# Altium schematic sheet modFOC-5VSupply.SchDoc
size A4; Organization: Altium Limited; Address1: L3, 12a Rodborough Rd; Address2: Frenchs Forest; Address3: NSW; Address4: Australia 2086
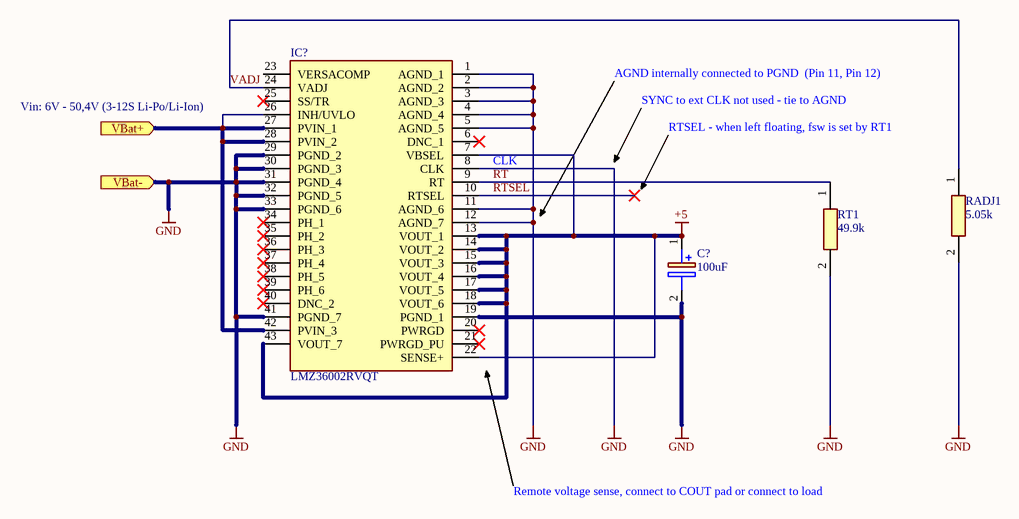
[diagram p0: modFOC-5VSupply.SchDoc]

## Parts
C?  100uF  [CAPPM3528X200N]
IC?  LMZ36002RVQT  [LMZ36002RVQR]
RADJ1  5.05k  [R0805]
RT1  49.9k  [R0805]

## Ports
VBat+ (in), VBat- (in)

## Nets
+5: C?.1(+) IC?.7(VBSEL) IC?.13(VOUT_1) IC?.14(VOUT_2) IC?.15(VOUT_3) IC?.16(VOUT_4) IC?.17(VOUT_5) IC?.18(VOUT_6) IC?.22(SENSE+) IC?.43(VOUT_7)
GND: C?.2(-) IC?.1(AGND_1) IC?.2(AGND_2) IC?.3(AGND_3) IC?.4(AGND_4) IC?.5(AGND_5) IC?.8(CLK) IC?.11(AGND_6) IC?.12(AGND_7) IC?.19(PGND_1) IC?.29(PGND_2) IC?.30(PGND_3) IC?.31(PGND_4) IC?.32(PGND_5) IC?.33(PGND_6) IC?.41(PGND_7) RADJ1.2 RT1.2 ; port VBat-
RT: IC?.9(RT) RT1.1
RTSEL: IC?.10(RTSEL)
VADJ: IC?.24(VADJ) RADJ1.1
VBat+: IC?.26(INH/UVLO) IC?.27(PVIN_1) IC?.28(PVIN_2) IC?.42(PVIN_3) ; port VBat+

Not connected (* = marked no-connect by the designer): IC? 6(DNC_1)* 20(PWRGD)* 21(PWRGD_PU)* 23(VERSACOMP) 25(SS/TR)* 34(PH_1)* 35(PH_2)* 36(PH_3)* 37(PH_4)* 38(PH_5)* 39(PH_6)* 40(DNC_2)*

## Notes on the sheet
- AGND internally connected to PGND  (Pin 11, Pin 12)
- (near IC?) Vin: 6V - 50,4V (3-12S Li-Po/Li-Ion)
- SYNC to ext CLK not used - tie to AGND
- RTSEL - when left floating, fsw is set by RT1
- (near IC?) CLK
- Remote voltage sense, connect to COUT pad or connect to load
- Title
- Size:
- Date:
- A4
- Number:
- Time:
- Revision:
- Sheet
- of
- File:

## Library data of the parts
C? = 8TPE100MAZB: Capacitor Polarised; Manufacturer_Name: Panasonic; Datasheet Link: http://uk.rs-online.com/web/p/products/7887374; Height: 2mm; Manufacturer_Part_Number: 8TPE100MAZB; Arrow Part Number: 8TPE100MAZB; Arrow Price/Stock: https://www.arrow.com/en/products/8tpe100mazb/panasonic; Mouser Part Number: 667-8TPE100MAZB; Mouser Price/Stock: https://www.mouser.co.uk/ProductDetail/Panasonic/8TPE100MAZB?qs=OE1iw1LrrPHKTwwfsidxgA%3D%3D
IC? = LMZ36002RVQT: Integrated Circuit; Manufacturer_Name: Texas Instruments; Datasheet Link: http://www.ti.com/lit/gpn/lmz36002; Height: 2.13mm; Manufacturer_Part_Number: LMZ36002RVQT; Arrow Part Number: LMZ36002RVQT; Arrow Price/Stock: https://www.arrow.com/en/products/lmz36002rvqt/texas-instruments; Mouser Part Number: 595-LMZ36002RVQT; Mouser Price/Stock: https://www.mouser.co.uk/ProductDetail/Texas-Instruments/LMZ36002RVQT?qs=kFLL9AfgRSBjXTxBMSjGOw%3D%3D
RADJ1 = RT0805BRD075K05L: Resistor; Manufacturer_Name: Yageo; Datasheet Link: https://www.mouser.at/datasheet/2/447/PYu-RT_1-to-0.01_RoHS_L_11-1669912.pdf; Height: 0.7mm; Manufacturer_Part_Number: RT0805BRD075K05L; Mouser Part Number: 603-RT0805BRD075K05L; Mouser Price/Stock: https://www.mouser.at/ProductDetail/Yageo/RT0805BRD075K05L?qs=bQfrgN9vNvwObDVrZ%2FDM5w%3D%3D
RT1 = ERJ-6ENF4992V: Resistor; Manufacturer_Name: Panasonic; Datasheet Link: https://industrial.panasonic.com/cdbs/www-data/pdf/RDA0000/AOA0000C84.pdf; Height: 0.7mm; Manufacturer_Part_Number: ERJ-6ENF4992V; Mouser Part Number: 667-ERJ-6ENF4992V; Mouser Price/Stock: https://www.mouser.com/Search/Refine.aspx?Keyword=667-ERJ-6ENF4992V